# EAGLE schematic Tester (EAGLE 8.3.1)
COPYRIGHT: based on Transistortester (microcontroller.net); PROJECT_INFO: extented version with backlight dimmer; PROJECT_NAME: Component Tester
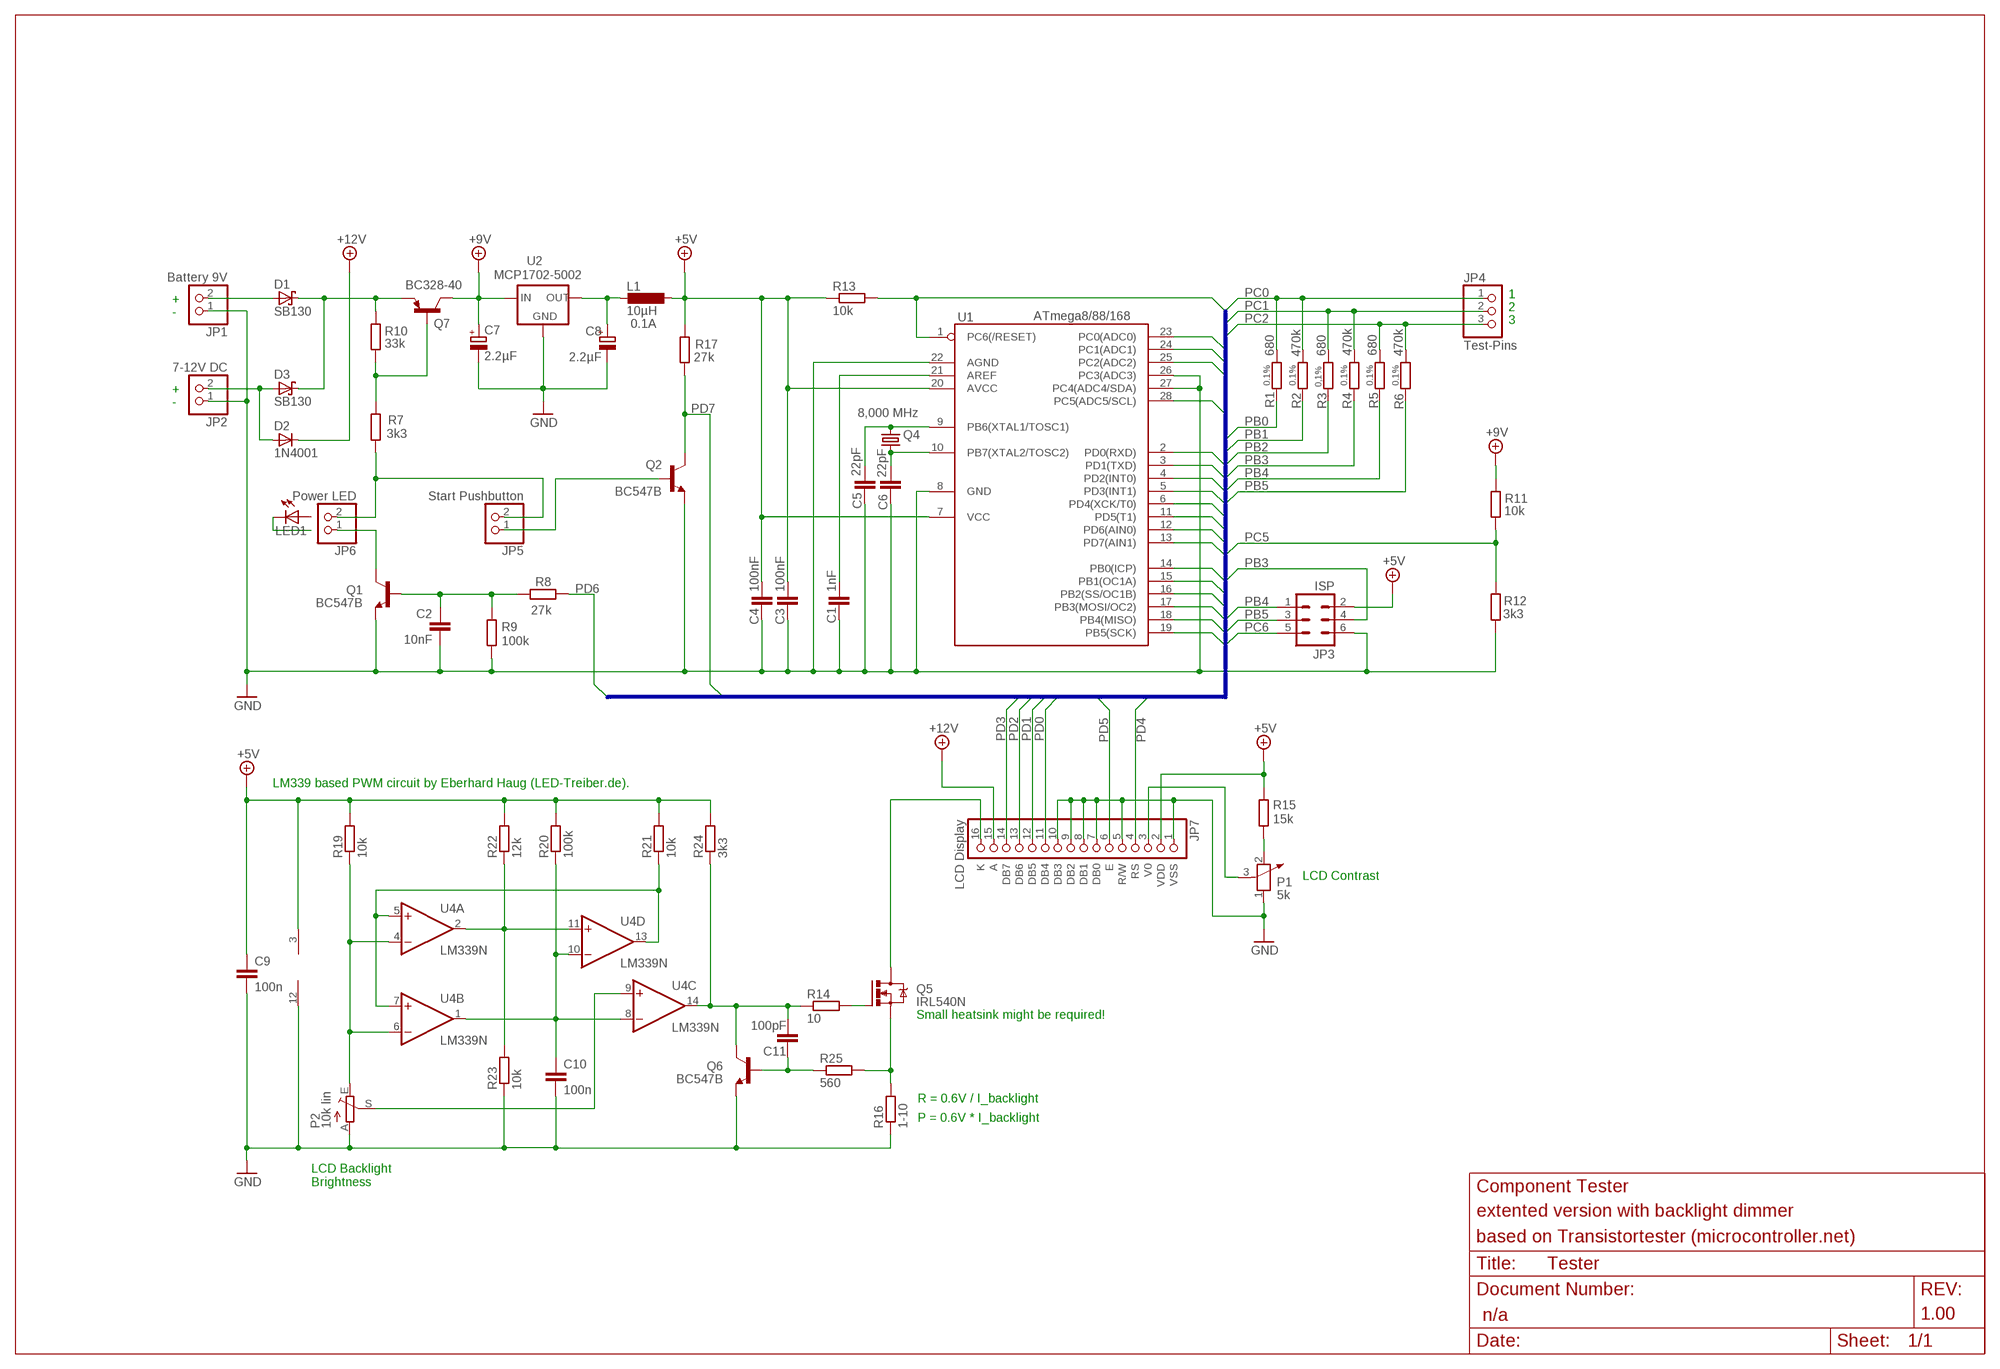
[diagram p0: schematic, sheet 1]
FRAME1 (FRAME_A3): DOCUMENT_ID: n/a; REVISION_ID: 1.00

## Parts
C1  1nF  C2.5/2  [C2.5-2]
C2  10nF  C2,5-3  [C2.5-3]
C3  100nF  C5/3  [C5B3]
C4  100nF  C5/3  [C5B3]
C5  22pF  C2,5-3  [C2.5-3]
C6  22pF  C2,5-3  [C2.5-3]
C7  2.2µF  CPOL-EUE5-5  [E5-5]
C8  2.2µF  CPOL-EUE5-5  [E5-5]
C9  100n  C-EU050-024X044  [C050-024X044]
C10  100n  C-EU050-024X044  [C050-024X044]
C11  100pF  C2.5/2  [C2.5-2]
D1  SB130  SCHOTTKY-DIODE_RAD3-5-A  [DIODE-3-5A-V]
D2  1N4001  DIODE_RAD3-5-A  [DIODE-3-5A-V]
D3  SB130  SCHOTTKY-DIODE_RAD3-5-A  [DIODE-3-5A-V]
JP1  Battery 9V  PINHD-1X2-PCB  [PINHD-1X02]
JP2  7-12V DC  PINHD-1X2-PCB  [PINHD-1X02]
JP3  ISP  ML6  [ML6]
JP4  Test-Pins  PINHD-1X3-PCB  [PINHD-1X03]
JP5  Start Pushbutton  PINHD-1X2-PCB  [PINHD-1X02]
JP6  Power LED  PINHD-1X2-PCB  [PINHD-1X02]
JP7  LCD Display  PINHD-1X16-LCD-TOP  [PINHD-1X16]
L1  10µH  L-EU0204/7  [0204/7]
LED1  LED_EXT  (no package)
P1  5k  POTENTIOMETER_PT-10  [PT-10]
P2  10k lin  TRIM_EU-LI10  [LI10]
Q1  BC547B  [TO92]
Q2  BC547B  [TO92]
Q4  8,000 MHz  CRYSTALHC49S  [HC49/S]
Q5  IRL540N  IRL540N-V  [TO220BV]
Q6  BC547B  [TO92]
Q7  BC328-40  [TO92-EBC]
R1  680  R-EU_0207/10  [0207/10]
R2  470k  R-EU_0207/10  [0207/10]
R3  680  R-EU_0207/10  [0207/10]
R4  470k  R-EU_0207/10  [0207/10]
R5  680  R-EU_0207/10  [0207/10]
R6  470k  R-EU_0207/10  [0207/10]
R7  3k3  R-EU_0207/10  [0207/10]
R8  27k  R-EU_0207/2V  [0207/2V]
R9  100k  R-EU_0207/2V  [0207/2V]
R10  33k  R-EU_0207/2V  [0207/2V]
R11  10k  R-EU_0207/2V  [0207/2V]
R12  3k3  R-EU_0207/2V  [0207/2V]
R13  10k  R-EU_0207/10  [0207/10]
R14  10  R-EU_0207/2V  [0207/2V]
R15  15k  R-EU_0207/10  [0207/10]
R16  1-10  R-EU_0207/10  [0207/10]
R17  27k  R-EU_0207/2V  [0207/2V]
R19  10k  R-EU_0207/2V  [0207/2V]
R20  100k  R-EU_0207/5V  [0207/5V]
R21  10k  R-EU_0207/2V  [0207/2V]
R22  12k  R-EU_0207/5V  [0207/5V]
R23  10k  R-EU_0207/5V  [0207/5V]
R24  3k3  R-EU_0207/5V  [0207/5V]
R25  560  R-EU_0207/5V  [0207/5V]
U1  ATmega8/88/168  MEGA8-P  [DIL28-3]
U2  MCP1702-5002  [TO92-LOWDROP]
U4  LM339N  [DIL14]

## Nets
+5V: C3.2 C4.1 C9.1 JP3.2 JP7.2(VDD) L1.1 R13.1 R15.1 R17.2 R19.2 R20.2 R21.2 R22.2 R24.2 U1.7(VCC) U1.20(AVCC) U4.3(P:V+)
+9V: C7.+ Q7.C R11.1 U2.IN
+12V: D2.C JP7.15(A)
BL_K: JP7.16(K) Q5.D
GND: C1.1 C2.2 C3.1 C4.2 C5.1 C6.1 C7.- C8.- C9.2 C10.2 JP1.1 JP2.1 JP3.6 JP7.1(VSS) JP7.5(R/W) JP7.7(DB0) JP7.8(DB1) JP7.9(DB2) JP7.10(DB3) P1.1 P2.A Q1.1(E) Q2.1(E) Q6.1(E) R9.1 R12.1 R16.1 R23.1 U1.8(GND) U1.22(AGND) U1.26(PC3(ADC3)) U1.27(PC4(ADC4/SDA)) U2.GND U4.12(P:GND)
N$1: P1.2 R15.2
N$2: JP7.3(V0) P1.3
N$3: Q5.S R16.2 R25.2
N$4: R22.1 R23.2 U4.2(A:OUT) U4.11(D:+IN)
N$5: D1.C D3.C Q7.E R10.1
N$6: C10.1 R20.1 U4.1(B:OUT) U4.8(C:-IN) U4.10(D:-IN)
N$7: R21.1 U4.5(A:+IN) U4.7(B:+IN) U4.13(D:OUT)
N$8: JP6.1 Q1.3(C)
N$9: D1.A JP1.2
N$10: C1.2 U1.21(AREF)
N$11: LED1.C
N$12: C5.2 Q4.2 U1.9(PB6(XTAL1/TOSC1))
N$13: C6.2 Q4.1 U1.10(PB7(XTAL2/TOSC2))
N$14: JP5.1 Q2.2(B)
N$15: P2.E R19.1 U4.4(A:-IN) U4.6(B:-IN)
N$16: P2.S U4.9(C:+IN)
N$17: C11.2 Q6.3(C) R14.1 R24.1 U4.14(C:OUT)
N$18: Q5.G R14.2
N$19: C11.1 Q6.2(B) R25.1
N$20: C8.+ L1.2 U2.OUT
N$21: JP5.2 JP6.2 R7.1
N$22: D2.A D3.A JP2.2
N$33: Q7.B R7.2 R10.2
N$35: C2.1 Q1.2(B) R8.2 R9.2
PB0: R1.1 U1.14(PB0(ICP))
PB1: R2.1 U1.15(PB1(OC1A))
PB2: R3.1 U1.16(PB2(SS/OC1B))
PB3: JP3.4 R4.1 U1.17(PB3(MOSI/OC2))
PB4: JP3.1 R5.1 U1.18(PB4(MISO))
PB5: JP3.3 R6.1 U1.19(PB5(SCK))
PC0: JP4.1 R1.2 R2.2 U1.23(PC0(ADC0))
PC1: JP4.2 R3.2 R4.2 U1.24(PC1(ADC1))
PC2: JP4.3 R5.2 R6.2 U1.25(PC2(ADC2))
PC5: R11.2 R12.2 U1.28(PC5(ADC5/SCL))
PC6: JP3.5 R13.2 U1.1(PC6(/RESET))
PD0: JP7.11(DB4) U1.2(PD0(RXD))
PD1: JP7.12(DB5) U1.3(PD1(TXD))
PD2: JP7.13(DB6) U1.4(PD2(INT0))
PD3: JP7.14(DB7) U1.5(PD3(INT1))
PD4: JP7.4(RS) U1.6(PD4(XCK/T0))
PD5: JP7.6(E) U1.11(PD5(T1))
PD6: R8.1 U1.12(PD6(AIN0))
PD7: Q2.3(C) R17.1 U1.13(PD7(AIN1))
Unconnected: LED1.A

## Buses
BUS1:PB[0..5],PC[0..6],PD[0..7]

## Notes on the sheet
- 1
- +
- 2
- -
- 3
- +
- -
- LM339 based PWM circuit by Eberhard Haug (LED-Treiber.de).
- LCD Contrast
- Small heatsink might be required!
- R = 0.6V / I_backlight
- P = 0.6V * I_backlight
- LCD Backlight
  Brightness

## Library data of the parts
C1 = capacitor-wima:C: CAPACITOR naming: grid - package width; MF: EPCOS; MPN: B32529C0102K000; OC_FARNELL: 9752897
C2-C6 C11 = capacitor-wima:C: CAPACITOR naming: grid - package width; OC_FARNELL: unknown
C7 C8 = rcl:CPOL-EU: POLARIZED CAPACITOR, European symbol; OC_FARNELL: unknown
C9 C10 = resistor:C-EU: CAPACITOR, European symbol; OC_FARNELL: unknown
D1 D3 = markus:SCHOTTKY-DIODE: Schottky Diode; OC_FARNELL: unknown
D2 = markus:DIODE: Diode; OC_FARNELL: unknown
JP1 JP2 JP5 JP6 = markus:PINHD-1X2-PCB: PIN HEADER; OC_FARNELL: unknown
JP3 = con-ml:ML6: HARTING; OC_FARNELL: unknown; OC_NEWARK: unknown
JP4 = markus:PINHD-1X3-PCB: PIN HEADER; OC_FARNELL: unknown
JP7 = markus:PINHD-1X16-LCD: Pin Header for LCD module 16 pin supports bottom and top types; OC_FARNELL: unknown
L1 = rcl:L-EU: INDUCTOR, European symbol; CURRENT: 0.1A; OC_FARNELL: unknown
LED1 = markus:LED_EXT: Standard LED; _EXTERNAL_: external device
P1 = rcl:POTENTIOMETER_: Potentiometer; OC_FARNELL: unknown
P2 = pot:TRIM_EU-: POTENTIOMETER; OC_FARNELL: unknown
Q1 Q2 Q6 = transistor-npn:BC547*: NPN Transistor; OC_FARNELL: unknown
Q4 = crystal:CRYSTAL: CRYSTAL; MF: MULTICOMP; MPN: HC49SM-3.6864-30-50-60-16-ATF; OC_FARNELL: 1667008; OC_NEWARK: unknown
Q5 = markus:IRL540N: HEXFET Power MOSFET Logic-Level Gate VDSS = 100V RDS(on) = 0.044Ω ID = 36A; OC_FARNELL: unknown
Q7 = transistor-pnp:BC328*: PNP Transistror; OC_FARNELL: unknown
R1 R2 R4-R6 = resistor:R-EU_: RESISTOR, European symbol; OC_FARNELL: unknown; TOLERANCE: 0.1%
R3 = resistor:R-EU_: RESISTOR, European symbol; OC_FARNELL: unknown; TOLERANCE: 0,1%
R7-R17 R19-R25 = resistor:R-EU_: RESISTOR, European symbol; OC_FARNELL: unknown
U1 = avr-6:MEGA8-P: MICROCONTROLLER 8 Kbytes FLASH 1 kbytes SRAM 512 bytes EEPROM USART 4-channel 10 bit ADC 2-channel 8 bit ADC; OC_FARNELL: unknown
U2 = asko:MCP1702-5002; OC_FARNELL: unknown
U4 = linear:LM339: Low Power Low Offset Voltage Quad Comparators with open collector; LM139/LM239/LM339/LM2901/LM3302; OC_FARNELL: unknown

## Net classes
0 default: width 0.406 mm, drill 0.8 mm